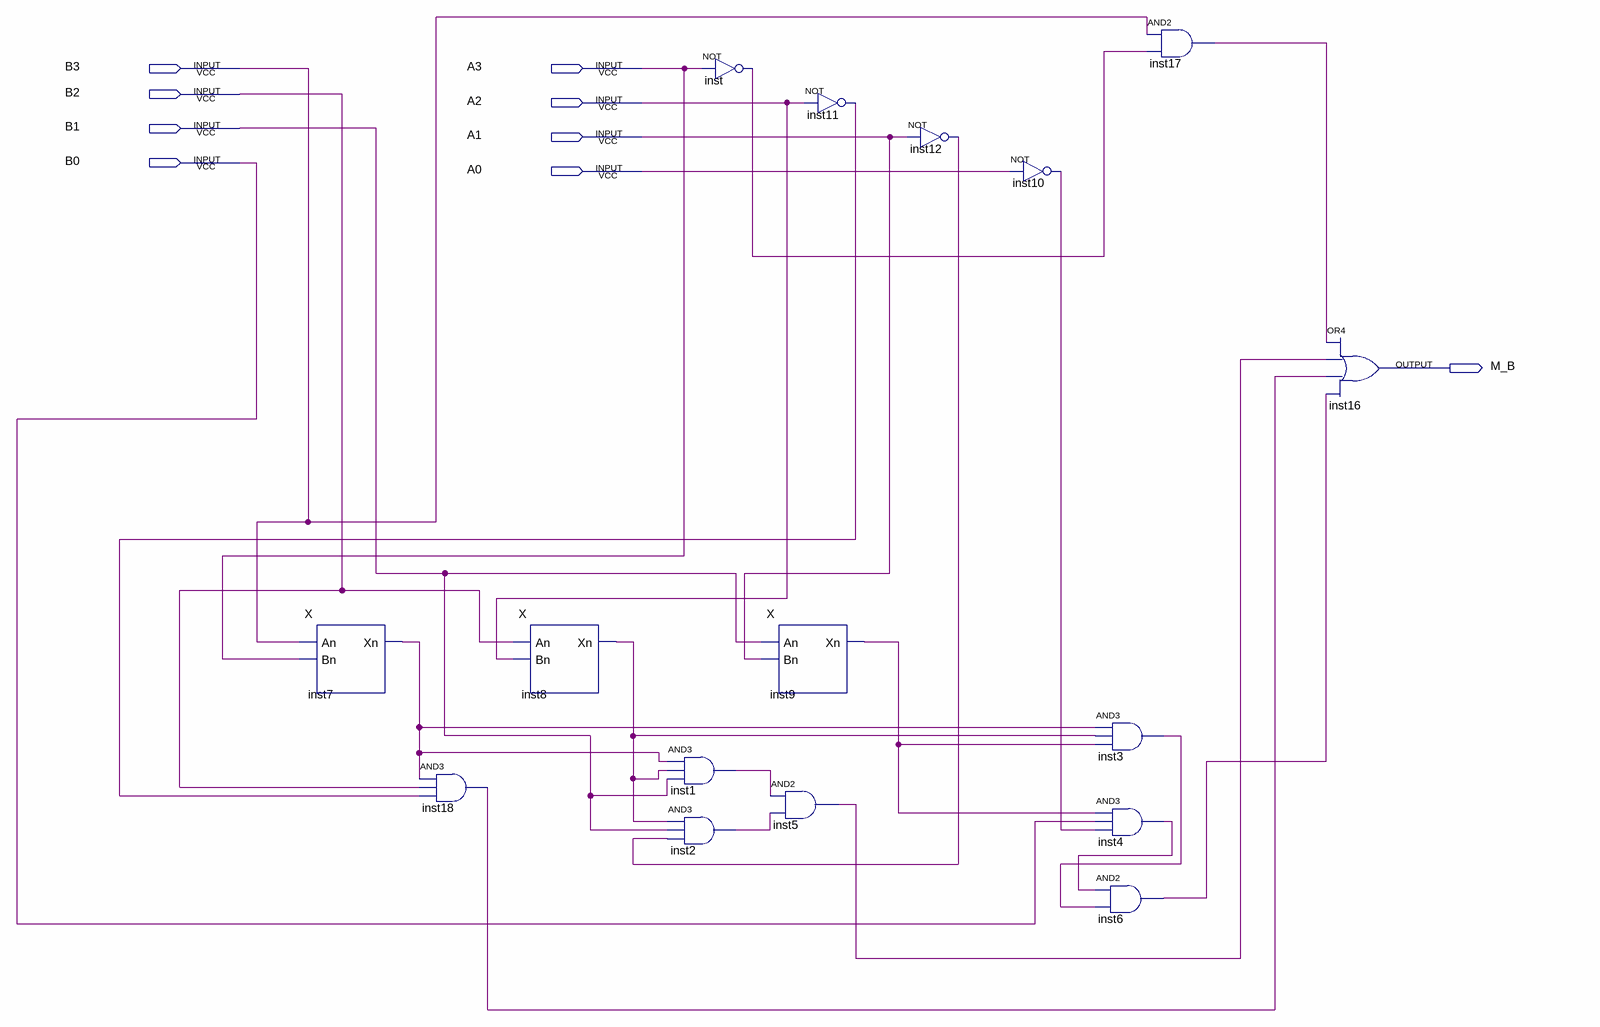
[diagram p0: schematic sheet]
// Quartus schematic CompMagnitude_M_B.bdf as structural Verilog: 16 symbols, 9 pins
module CompMagnitude_M_B (
  input  B3,
  input  A3,
  input  B2,
  input  A2,
  input  B1,
  input  A1,
  input  B0,
  input  A0,
  output M_B
);

  wire inst1_out, inst2_out, inst3_out, inst4_out, inst5_out, inst6_out, inst7_xn, inst8_xn, inst9_xn,
       inst10_out, inst11_out, inst12_out, inst17_out, inst18_out, inst_out;

  X inst7 (.An(B3), .Bn(A3), .Xn(inst7_xn));
  and inst18 (inst18_out, inst7_xn, B2, inst11_out);
  X inst8 (.An(B2), .Bn(A2), .Xn(inst8_xn));
  and inst1 (inst1_out, inst7_xn, inst8_xn, B1);
  and inst2 (inst2_out, inst8_xn, B1, inst12_out);
  not inst (inst_out, A3);
  not inst11 (inst11_out, A2);
  X inst9 (.An(B1), .Bn(A1), .Xn(inst9_xn));
  and inst5 (inst5_out, inst1_out, inst2_out);
  not inst12 (inst12_out, A1);
  not inst10 (inst10_out, A0);
  and inst17 (inst17_out, B3, inst_out);
  and inst3 (inst3_out, inst7_xn, inst8_xn, inst9_xn);
  and inst4 (inst4_out, inst9_xn, B0, inst10_out);
  and inst6 (inst6_out, inst4_out, inst3_out);
  or inst16 (M_B, inst17_out, inst5_out, inst18_out, inst6_out);
endmodule
